# EasyEDA Pro project ProDocument_Board1612_2023-10-08.epro

# Schematic Schematic1_1
Create Date: 2023-08-06; Page Name: P1; Project Name: PressureSensor; Schematic Name: Schematic1_1; Update Date: 2023-08-13; Company: 嘉立创EDA; Page Size: A4; Version: V1.0
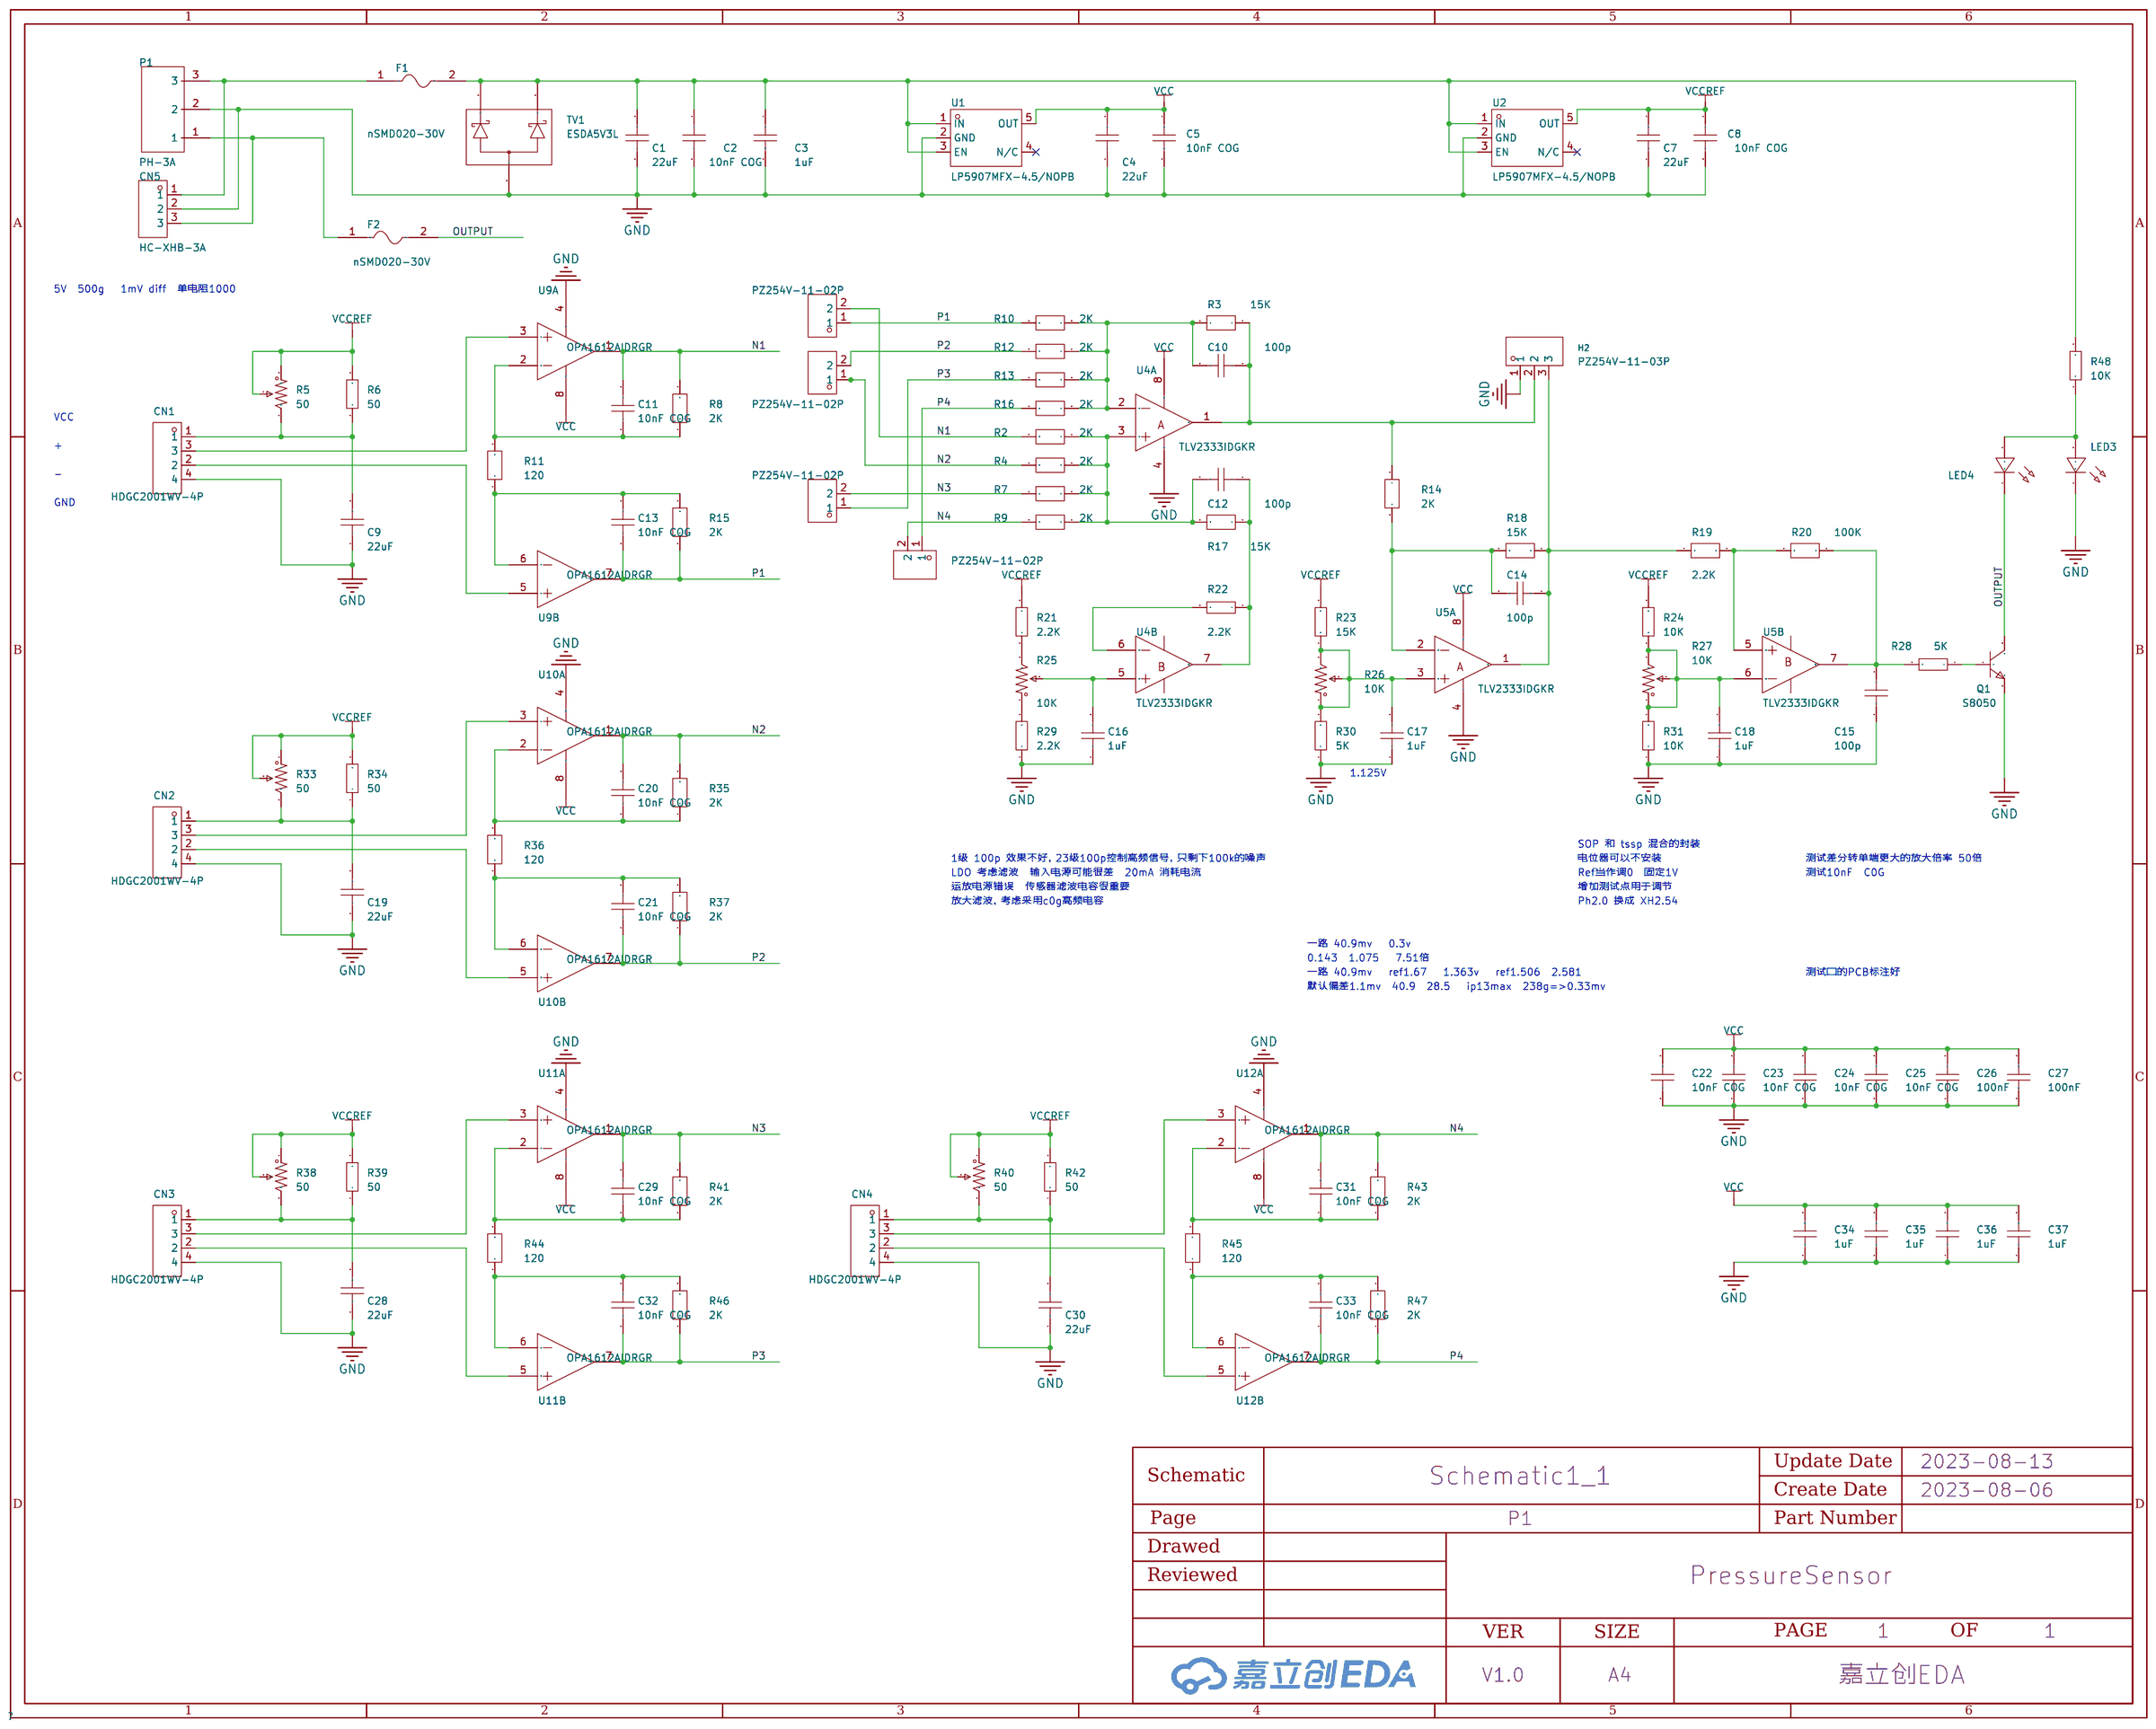
[diagram p0: schematic sheet]

## Parts
C1  22uF  [R0603]
C2  10nF COG  [R0603]
C3  1uF  [R0603]
C4  22uF  [R0603]
C5  10nF COG  [R0603]
C7  22uF  [R0603]
C8  10nF COG  [R0603]
C9  22uF  [R0603]
C10  100p  [R0603]
C11  10nF COG  [R0603]
C12  100p  [R0603]
C13  10nF COG  [R0603]
C14  100p  [R0603]
C15  100p  [R0603]
C16  1uF  [R0603]
C17  1uF  [R0603]
C18  1uF  [R0603]
C19  22uF  [R0603]
C20  10nF COG  [R0603]
C21  10nF COG  [R0603]
C22  10nF COG  [R0603]
C23  10nF COG  [R0603]
C24  10nF COG  [R0603]
C25  10nF COG  [R0603]
C26  100nF  [R0603]
C27  100nF  [R0603]
C28  22uF  [R0603]
C29  10nF COG  [R0603]
C30  22uF  [R0603]
C31  10nF COG  [R0603]
C32  10nF COG  [R0603]
C33  10nF COG  [R0603]
C34  1uF  [R0603]
C35  1uF  [R0603]
C36  1uF  [R0603]
C37  1uF  [R0603]
CN1  HDGC2001WV-4P  [CONN-TH_4P-P2.00_HDGC_HDGC2001WV-4P]
CN2  HDGC2001WV-4P  [CONN-TH_4P-P2.00_HDGC_HDGC2001WV-4P]
CN3  HDGC2001WV-4P  [CONN-TH_4P-P2.00_HDGC_HDGC2001WV-4P]
CN4  HDGC2001WV-4P  [CONN-TH_4P-P2.00_HDGC_HDGC2001WV-4P]
CN5  HC-XHB-3A  [CONN-TH_3P-P2.50_HC-XHB-3A]
F1  nSMD020-30V  [F1206]
F2  nSMD020-30V  [F1206]
H2  PZ254V-11-03P  [HDR-TH_3P-P2.54-V-M]
H5  PZ254V-11-02P  [HDR-TH_2P-P2.54-V-M]
H6  PZ254V-11-02P  [HDR-TH_2P-P2.54-V-M]
H7  PZ254V-11-02P  [HDR-TH_2P-P2.54-V-M]
H8  PZ254V-11-02P  [HDR-TH_2P-P2.54-V-M]
LED3  -  [LED_0603]
LED4  -  [LED_0603]
P1  PH-3A  [CONN-TH_12P-P2.00-H-W4.8_PH-3A]
Q1  S8050  [SOT-23-3_L2.9-W1.6-P1.90-LS2.8-BR]
R2  2K  [R0603]
R3  15K  [R0603]
R4  2K  [R0603]
R5  50  [RES-ADJ-TH_3P-L10.0-W10.0-P2.50-L]
R6  50  [R0603]
R7  2K  [R0603]
R8  2K  [R0603]
R9  2K  [R0603]
R10  2K  [R0603]
R11  120  [R0603]
R12  2K  [R0603]
R13  2K  [R0603]
R14  2K  [R0603]
R15  2K  [R0603]
R16  2K  [R0603]
R17  15K  [R0603]
R18  15K  [R0603]
R19  2.2K  [R0603]
R20  100K  [R0603]
R21  2.2K  [R0603]
R22  2.2K  [R0603]
R23  15K  [R0603]
R24  10K  [R0603]
R25  10K  [RES-ADJ-TH_3P-L10.0-W10.0-P2.50-L]
R26  10K  [RES-ADJ-TH_3P-L10.0-W10.0-P2.50-L]
R27  10K  [RES-ADJ-TH_3P-L10.0-W10.0-P2.50-L]
R28  5K  [R0603]
R29  2.2K  [R0603]
R30  5K  [R0603]
R31  10K  [R0603]
R33  50  [RES-ADJ-TH_3P-L10.0-W10.0-P2.50-L]
R34  50  [R0603]
R35  2K  [R0603]
R36  120  [R0603]
R37  2K  [R0603]
R38  50  [RES-ADJ-TH_3P-L10.0-W10.0-P2.50-L]
R39  50  [R0603]
R40  50  [RES-ADJ-TH_3P-L10.0-W10.0-P2.50-L]
R41  2K  [R0603]
R42  50  [R0603]
R43  2K  [R0603]
R44  120  [R0603]
R45  120  [R0603]
R46  2K  [R0603]
R47  2K  [R0603]
R48  10K  [R0603]
TV1  ESDA5V3L  [SOT-23-3_L2.9-W1.6-P1.90-LS2.8-BR]
U1  LP5907MFX-4.5/NOPB  [TSOT-23-5_L2.9-W1.6-P0.95-LS2.8-BR]
U2  LP5907MFX-4.5/NOPB  [TSOT-23-5_L2.9-W1.6-P0.95-LS2.8-BR]
U4  TLV2333IDGKR  [SOIC-8_L4.9-W3.9-P1.27-LS6.0-BL]  (sections 1,2)
U5  TLV2333IDGKR  [SOIC-8_L4.9-W3.9-P1.27-LS6.0-BL]  (sections 1,2)
U9  OPA1612AIDRGR  [SON-8_L3.0-W3.0-P0.50-TL-EP_OPA1612AIDRGR]  (sections 1,2)
U10  OPA1612AIDRGR  [SON-8_L3.0-W3.0-P0.50-TL-EP_OPA1612AIDRGR]  (sections 1,2)
U11  OPA1612AIDRGR  [SON-8_L3.0-W3.0-P0.50-TL-EP_OPA1612AIDRGR]  (sections 1,2)
U12  OPA1612AIDRGR  [SON-8_L3.0-W3.0-P0.50-TL-EP_OPA1612AIDRGR]  (sections 1,2)

## Library data of the parts
C1-C5 C7-C37 = CAP_0603: Supplier Footprint: 0603
CN1-CN4 = HDGC2001WV-4P: LCSC Part Name: PH2.0直针 4P; Supplier Part: C5175232; Manufacturer: HDGC(华德共创); Supplier Footprint: 直插,P=2mm; JLCPCB Part Class: Extended Part; Datasheet: https://atta.szlcsc.com/upload/public/pdf/source/20220916/C6875813FFA1039A4B3E585D63AEFA0D.pdf; Supplier: LCSC
CN5 = HC-XHB-3A_C2845491: 参考系列:-;间距:2.5mm;插针结构:1x3P;排数:1;每排PIN数:3;行距:-;公母:公型插针;安装方式:直插;额定电流:3A;工作温度范围:-25℃~+85℃;; LCSC Part Name: 2.54带锁扣立式插件 3P 针座连接器线对板/线对线连接器; Supplier Part: C2845491; Manufacturer: HCTL(华灿天禄); Supplier Footprint: 插件,P=2.5mm; JLCPCB Part Class: Extended Part; Datasheet: https://atta.szlcsc.com/upload/public/pdf/source/20210728/C2845490_C6E0123D5C5ECC46C6D4C91ADB43F484.pdf; Supplier: LCSC; Pitch: 2.5mm; Pins Structure: 1x3P; Number of Rows: 1; Number of PINs Per Row: 3; Gender: 公型插针; Mounting Style: 直插; Current Rating (Max): 3A; Operating Temperature Range: -25℃~+85℃
F1 F2 = nSMD020-30V: 最大电压:30V;最大电流:100A;保持电流:200mA;跳闸电流:460mA;; LCSC Part Name: 30V 200mA 1206自恢复; Supplier Part: C69680; Manufacturer: 台湾陆海; Supplier Footprint: 1206; JLCPCB Part Class: Extended Part; Datasheet: https://atta.szlcsc.com/upload/public/pdf/source/20230404/9F5B471D89C649BCC2835D46521A6324.pdf; Supplier: LCSC; Operating Voltage (Max): 30V; Current Rating (Max): 100A; Hold Current: 200mA; Trip Current: 460mA
H2 = PZ254V-11-03P: 排数:单排;总PIN位数:3;间距:2.54mm;插针结构:1x3P;行距:-;安装类型:直插;圆针/方针:方针;额定电流:3A;额定电压:250V;配合针长度:6mm;塑高:2.5mm;端接针长度:3mm;工作温度范围:-40℃~+105℃;颜色:黑色;; LCSC Part Name: 2.54mm 1x3P 直插 方针; Supplier Part: C2937625; Manufacturer: XFCN(兴飞); Supplier Footprint: 直插,P=2.54mm; JLCPCB Part Class: Extended Part; Datasheet: 2022-07-12/581362A/62b9d00620994b3696be7eb4af85ad72/双排排针和单排排针.pdf; Supplier: LCSC; Number of Rows: 单排; Number of Pins: 3; Pitch: 2.54mm; Pin Structure: 1x3P; Mounting Type: 直插; Circluar Pins/Square Pins: 方针; Current Rating (Max): 3A; Voltage Rating (Max): 250V; Length of Mating Pin: 6mm; Insulation Height: 2.5mm; Length of End Connection Pin: 3mm; Operating Temperature Range: -40℃~+105℃; Color: 黑色
H5-H8 = PZ254V-11-02P: 排数:单排;总PIN位数:2P;间距:2.54mm;插针结构:1x2P;行距:-;安装类型:直插;圆针/方针:方针;额定电流:-;额定电压:-;配合针长度:6mm;塑高:2.5mm;端接针长度:3mm;触头材质:黄铜;触头镀层:-;工作温度范围:-40℃~+105℃;颜色:黑色;; LCSC Part Name: 2.54mm 1x2P 直插 方针; Supplier Part: C492401; Manufacturer: XFCN(兴飞); Supplier Footprint: 插件,P=2.54mm; JLCPCB Part Class: Extended Part; Datasheet: https://atta.szlcsc.com/upload/public/pdf/source/20200309/C492401_A812433581A9B211A7FFA413ADDFF0E5.pdf; Supplier: LCSC; Number of Rows: 单排; Number of Pins: 2P; Pitch: 2.54mm; Pin Structure: 1x2P; Mounting Type: 直插; Circluar Pins/Square Pins: 方针; Length of Mating Pin: 6mm; Insulation Height: 2.5mm; Length of End Connection Pin: 3mm; Contact Material: 黄铜; Operating Temperature Range: -40℃~+105℃; Color: 黑色
LED3 LED4 = LED_0603-B: Supplier Footprint: 0603
P1 = PH-3A_C2320: 参考系列:PH;间距:2mm;插针结构:1x3P;排数:1;每排PIN数:3;行距:-;安装方式:-;触头材质:-;; LCSC Part Name: PH 2mm 1x3P 直插; Supplier Part: C2320; Manufacturer: BOOMELE(博穆精密); Supplier Footprint: 插件,P=2mm; JLCPCB Part Class: Extended Part; Datasheet: https://atta.szlcsc.com/upload/public/pdf/source/20151118/1457707579328.pdf; Supplier: LCSC; Reference Series: PH; Pitch: 2mm; Pins Structure: 1x3P; Number of Rows: 1; Number of PINs Per Row: 3
Q1 = S8050_C105433: 晶体管类型:NPN;集射极击穿电压(Vceo):25V;集电极电流(Ic):500mA;功率(Pd):300mW;直流电流增益(hFE@Ic,Vce):120@50mA,1V;; LCSC Part Name: NPN 25V 500mA L档 120-200; Supplier Part: C105433; Manufacturer: CJ(江苏长电/长晶); Supplier Footprint: SOT-23; JLCPCB Part Class: Extended Part; Datasheet: https://atta.szlcsc.com/upload/public/pdf/source/20170415/1492237762328.pdf; Supplier: LCSC; Transistor Type: NPN; Collector-Emitter Breakdown Voltage (Vceo): 25V; Collector Current (Ic): 500mA; Power Dissipation (Pd): 300mW; Collector Cut-Off Current (Icbo): 100nA; Collector-Emitter Saturation Voltage (VCE(sat)@Ic,Ib): 600mV@500mA,50mA; DC Current Gain (hFE@Ic,Vce): 120@50mA,1V; Transition Frequency (fT): 150MHz; Operating Temperature: +150℃@(Tj)
R2-R4 R7-R20 R35-R37 R41 R43-R47 = ARG02BTC4R70: 阻值:4.7Ω;精度:±0.1%;温度系数:±25ppm/℃;; LCSC Part Name: 4.7Ω ±0.1%; Supplier Part: C2984422; Manufacturer: Viking(光颉); Supplier Footprint: 0402; JLCPCB Part Class: Extended Part; Datasheet: https://atta.szlcsc.com/upload/public/pdf/source/20200117/C485675_99063924B4564AF910B7BE66DA8EFA49.pdf; Supplier: LCSC; Tolerance: ±0.1%; Temperature Coefficient: ±25ppm/℃
R5 R25-R27 R33 R38 R40 = 3296W-1-103: 阻值:10kΩ;精度:±10%;; LCSC Part Name: 10kΩ ±10%; Supplier Part: C118954; Manufacturer: BOCHEN(博晨); Supplier Footprint: 插件; JLCPCB Part Class: Extended Part; Datasheet: https://atta.szlcsc.com/upload/public/pdf/source/20171114/C118954_15106326646611117443.pdf; Supplier: LCSC; Tolerance: ±10%
R6 R21-R24 R28-R31 R34 R39 R42 R48 = Res_0603: Supplier Footprint: 0603
TV1 = ESDA5V3L_C87911: Supplier Part: C87911; Manufacturer: ST(意法半导体); Supplier Footprint: SOT-23; JLCPCB Part Class: Extended Part; Datasheet: https://atta.szlcsc.com/upload/public/pdf/source/20161123/1479873117957.pdf; Supplier: LCSC
U1 U2 = LP5907MFX-4.5/NOPB: 输出类型:-;; Supplier Part: C529554; Manufacturer: TI(德州仪器); Supplier Footprint: SOT-23-5; JLCPCB Part Class: Extended Part; Datasheet: https://atta.szlcsc.com/upload/public/pdf/source/20200515/C529554_1F6A3CAA36CA0E645A19879A5E39A7AD.pdf; Supplier: LCSC
U4 U5 = TLV2333IDGKR: 放大器组数:-;; Supplier Part: C527573; Manufacturer: TI(德州仪器); Supplier Footprint: VSSOP-8; JLCPCB Part Class: Extended Part; Datasheet: https://atta.szlcsc.com/upload/public/pdf/source/20200508/C527573_3F1EAB2C8CE40A63573F2737A046710C.pdf; Supplier: LCSC
U9-U12 = OPA1612AIDRGR: 具有 1.1nV/√Hz 噪声和较低 THD 的高精度 SoundPlus 音频运算放大器 8-SON -40 to 85; Supplier Part: C2058640; Manufacturer: TI(德州仪器); Supplier Footprint: SON-8-EP(3x3); JLCPCB Part Class: Extended Part; Datasheet: https://atta.szlcsc.com/upload/public/pdf/source/20230222/7014F0FC761208C0B48090C82932DC0C.pdf; Supplier: LCSC

## Nets
GND: C1.1 C2.2 C3.2 C4.1 C5.2 C7.1 C8.2 C9.1 C15.2 C16.1 C17.1 C18.1 C19.1 C22.1 C23.1 C24.1 C25.1 C26.1 C27.1 C28.1 C30.1 C34.1 C35.1 C36.1 C37.1 CN1.4 CN2.4 CN3.4 CN4.4 CN5.2 H2.1 LED3.1(C) P1.2 Q1.2 R29.1 R30.1 R31.1 TV1.3 U1.2(GND) U2.2(GND) U4.4(V-) U5.4(V-) U9.4(GND) U10.4(GND) U11.4(GND) U12.4(GND)
VCC: C4.2 C5.1 C22.2 C23.2 C24.2 C25.2 C26.2 C27.2 C34.2 C35.2 C36.2 C37.2 U1.5(OUT) U4.8(V+) U5.8(V+) U9.8(V+) U10.8(V+) U11.8(V+) U12.8(V+)
VCCREF: C7.2 C8.1 R5.1 R5.2 R6.2 R21.2 R23.2 R24.2 R33.1 R33.2 R34.2 R38.1 R38.2 R39.2 R40.1 R40.2 R42.2 U2.5(OUT)
N1: C11.2 H5.2 R2.2 R8.2 U9.1(OUTA)
N2: C20.2 H8.1 R4.2 R35.2 U10.1(OUTA)
N3: C29.2 H6.2 R7.2 R41.2 U11.1(OUTA)
N4: C31.2 H7.2 R9.2 R43.2 U12.1(OUTA)
OUTPUT: F2.2 LED4.1(C) Q1.3
P1: C13.1 H5.1 R10.2 R15.1 U9.7(OUTB)
P2: C21.1 H8.2 R12.2 R37.1 U10.7(OUTB)
P3: C32.1 H6.1 R13.2 R46.1 U11.7(OUTB)
P4: C33.1 H7.1 R16.2 R47.1 U12.7(OUTB)
$1N30553: CN1.3 U9.3(INA+)
$1N30561: CN1.2 U9.5(INB+)
$1N30605: C11.1 R8.1 R11.2 U9.2(INA-)
$1N30608: C13.2 R11.1 R15.2 U9.6(INB-)
$1N32010: R21.1 R25.3
$1N32012: R25.1 R29.2
$1N32045: C16.2 R25.2 U4.5(INB+)
$1N32103: R22.2 U4.6(INB-)
$1N32162: C10.2 R3.2 R10.1 R12.1 R13.1 R16.1 U4.2(INA-)
$1N32193: C12.1 R17.1 R22.1 U4.7(OUTB)
$1N32196: C12.2 R2.1 R4.1 R7.1 R9.1 R17.2 U4.3(INA+)
$1N33007: R19.2 R20.2 U5.5(INB+)
$1N33240: Q1.1 R28.1
$1N33276: C15.1 R20.1 R28.2 U5.7(OUTB)
$1N35532: C10.1 H2.2 R3.1 R14.1 U4.1(OUTA)
$1N36334: C14.1 H2.3 R18.1 R19.1 U5.1(OUTA)
$1N36352: C14.2 R14.2 R18.2 U5.2(INA-)
$1N36780: CN2.3 U10.3(INA+)
$1N36784: CN2.2 U10.5(INB+)
$1N36792: C20.1 R35.1 R36.2 U10.2(INA-)
$1N36797: C21.2 R36.1 R37.2 U10.6(INB-)
$1N37205: CN3.3 U11.3(INA+)
$1N37209: CN3.2 U11.5(INB+)
$1N37217: C29.1 R41.1 R44.2 U11.2(INA-)
$1N37222: C32.2 R44.1 R46.2 U11.6(INB-)
$1N37630: CN4.3 U12.3(INA+)
$1N37634: CN4.2 U12.5(INB+)
$1N37642: C31.1 R43.1 R45.2 U12.2(INA-)
$1N37647: C33.2 R45.1 R47.2 U12.6(INB-)
$1N37723: C19.2 CN2.1 R33.3 R34.1
$1N37747: C28.2 CN3.1 R38.3 R39.1
$1N37752: C9.2 CN1.1 R5.3 R6.1
$1N37762: C30.2 CN4.1 R40.3 R42.1
$1N42503: CN5.1 F1.1 P1.3
$1N42542: CN5.3 F2.1 P1.1
$1N42787: LED3.2(A) LED4.2(A) R48.1
$1N42798: C1.2 C2.1 C3.1 F1.2 R48.2 TV1.1 TV1.2 U1.1(IN) U1.3(EN) U2.1(IN) U2.3(EN)
$1N53934: C17.2 R23.1 R26.1 R26.2 R26.3 R30.2 U5.3(INA+)
$1N61093: C18.2 R24.1 R27.1 R27.2 R27.3 R31.2 U5.6(INB-)

Not connected (* = marked no-connect by the designer): U1 4(N/C)*; U2 4(N/C)*

## Notes on the sheet
- 5V  500g   1mV diff  单电阻1000
- VCC
- +
- -
- GND
- 1.125V
- SOP 和 tssp 混合的封装
- 1级 100p 效果不好，23级100p控制高频信号，只剩下100k的噪声
- 电位器可以不安装
- 测试差分转单端更大的放大倍率 50倍
- LDO 考虑滤波  输入电源可能很差  20mA 消耗电流
- 运放电源错误  传感器滤波电容很重要
- Ref当作调0  固定1V
- 增加测试点用于调节
- 测试10nF  C0G
- 放大滤波，考虑采用c0g高频电容
- Ph2.0 换成 XH2.54
- 一路 40.9mv   0.3v
- 0.143  1.075   7.51倍
- 一路 40.9mv   ref1.67   1.363v   ref1.506  2.581
- 默认偏差1.1mv  40.9  28.5   ip13max  238g=>0.33mv
- 测试口的PCB标注好

# Board PCB1_1
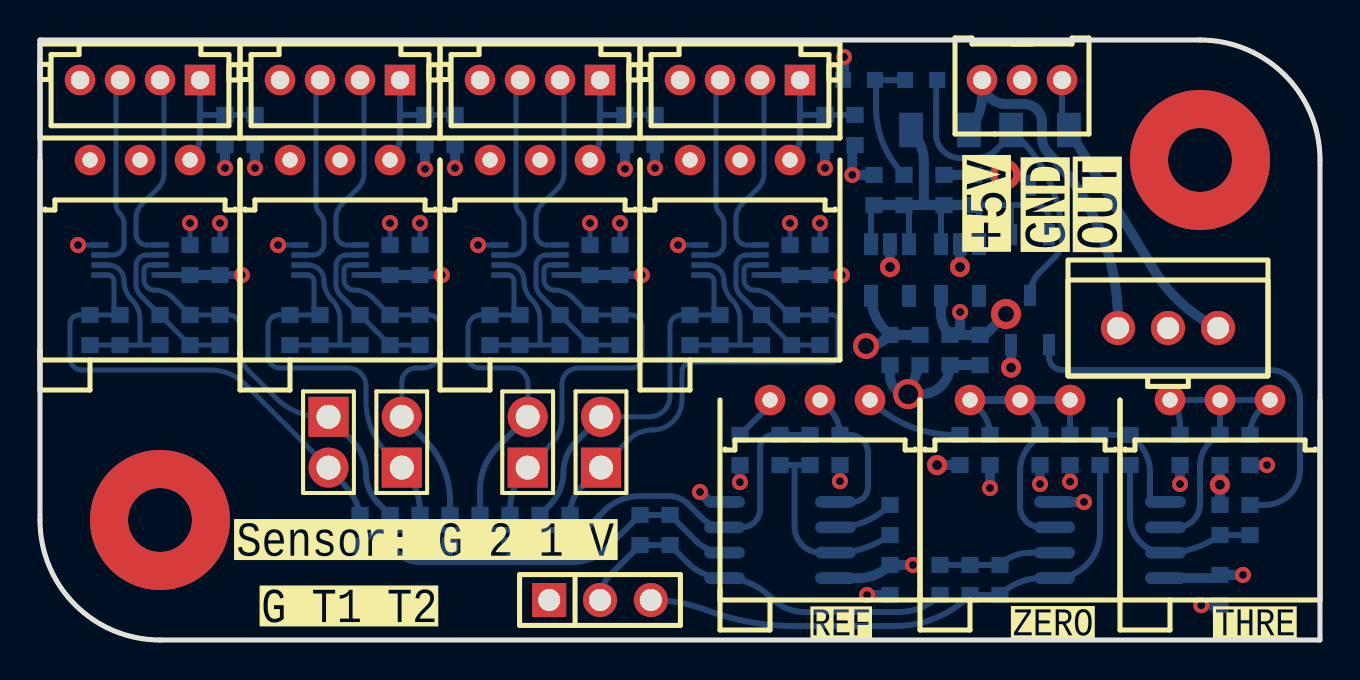
[diagram p1: board, top side]
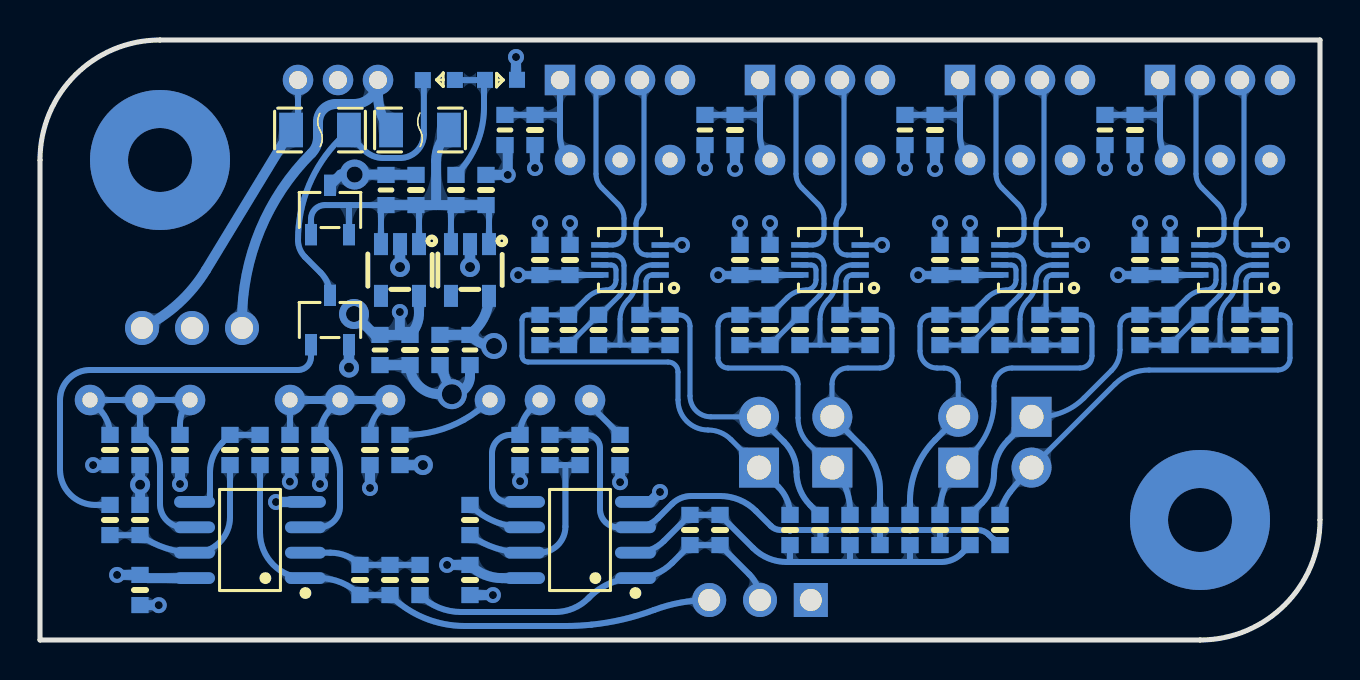
[diagram p2: board, bottom side, seen from below]

Outline 64 x 30 mm; copper layers: Top Layer, Inner1, Inner2, Bottom Layer. Coordinates in mm from the lower left corner of the outline.
Outline path: 0,6 0,30 58,30 arc(62.24,28.24) 64,24 64,0 6,0 arc(1.76,1.76) 0,6
Stack: Top Layer 0.035mm / Dielectric1 0.48mm PP er 4.5 / Inner1 0.035mm / Dielectric2 0.48mm FR4 er 4.5 / Inner2 0.035mm / Dielectric3 0.48mm PP er 4.5 / Bottom Layer 0.035mm

## Design rules (mm)
template: 自定义配置
spacing copperThickness1oz (default): track to track 0.102, other pairs 0.152 to 0.3
spacing copperThickness2oz: track to track 0.203, other pairs 0.152 to 0.3
track width copperThickness1oz (default): min 0.127, default 0.254, max 2.54
track width copperThickness2oz: min 0.203, default 0.254, max 2.54
differential pair differentialPair (default): width min 0.127, default 0.254, max 2.54; gap min 0.152, default 0.152
via viaSize (default): diameter min 0.5, default 0.61, max 10; hole min 0.3, default 0.305, max 6.3
net GND uses innerPlaneGND

## Placement (name value [footprint] x y rotation side)
C1  22uF  [R0603]  46.7 22.5 270 bottom
C2  10nF COG  [R0603]  45.2 22.5 90 bottom
C3  1uF  [R0603]  41.7 22.5 90 bottom
C4  22uF  [R0603]  42.5 14.5 90 bottom
C5  10nF COG  [R0603]  44 14.5 270 bottom
C7  22uF  [R0603]  47 14.5 90 bottom
C8  10nF COG  [R0603]  45.5 14.5 270 bottom
C9  22uF  [R0603]  10.75 25.5 90 bottom
C10  100p  [R0603]  31.5 5.5 90 bottom
C11  10nF COG  [R0603]  2.5 15.5 90 bottom
C12  100p  [R0603]  38.5 9.5 90 bottom
C13  10nF COG  [R0603]  9 15.5 270 bottom
C14  100p  [R0603]  46.5 3 90 bottom
C15  100p  [R0603]  59 6 90 bottom
C16  1uF  [R0603]  40 9.5 90 bottom
C17  1uF  [R0603]  50 9.5 90 bottom
C18  1uF  [R0603]  59 9.5 90 bottom
C19  22uF  [R0603]  20.75 25.5 90 bottom
C20  10nF COG  [R0603]  12.5 15.5 90 bottom
C21  10nF COG  [R0603]  19 15.5 270 bottom
C22  10nF COG  [R0603]  7.5 19 270 bottom
C23  10nF COG  [R0603]  17.5 19 270 bottom
C24  10nF COG  [R0603]  27.5 19 270 bottom
C25  10nF COG  [R0603]  37.5 19 270 bottom
C26  100nF  [R0603]  42.5 3 90 bottom
C27  100nF  [R0603]  59 2.5 90 bottom
C28  22uF  [R0603]  30.75 25.5 90 bottom
C29  10nF COG  [R0603]  22.5 15.5 90 bottom
C30  22uF  [R0603]  40.75 25.5 90 bottom
C31  10nF COG  [R0603]  32.5 15.5 90 bottom
C32  10nF COG  [R0603]  29 15.5 270 bottom
C33  10nF COG  [R0603]  39 15.5 270 bottom
C34  1uF  [R0603]  39 19 270 bottom
C35  1uF  [R0603]  29 19 270 bottom
C36  1uF  [R0603]  19 19 270 bottom
C37  1uF  [R0603]  9 19 270 bottom
CN1  HDGC2001WV-4P  [CONN-TH_4P-P2.00_HDGC_HDGC2001WV-4P]  5 28 180 top
CN2  HDGC2001WV-4P  [CONN-TH_4P-P2.00_HDGC_HDGC2001WV-4P]  15 28 180 top
CN3  HDGC2001WV-4P  [CONN-TH_4P-P2.00_HDGC_HDGC2001WV-4P]  25 28 180 top
CN4  HDGC2001WV-4P  [CONN-TH_4P-P2.00_HDGC_HDGC2001WV-4P]  35 28 180 top
CN5  HC-XHB-3A  [CONN-TH_3P-P2.50_HC-XHB-3A]  56.4 15.6 0 top
F1  nSMD020-30V  [F1206]  45 25.5 180 bottom
F2  nSMD020-30V  [F1206]  50 25.5 180 bottom
H2  PZ254V-11-03P  [HDR-TH_3P-P2.54-V-M]  28 2 0 top
H5  PZ254V-11-02P  [HDR-TH_2P-P2.54-V-M]  14.42 9.89 270 top
H6  PZ254V-11-02P  [HDR-TH_2P-P2.54-V-M]  24.38 9.89 90 top
H7  PZ254V-11-02P  [HDR-TH_2P-P2.54-V-M]  28.05 9.89 90 top
H8  PZ254V-11-02P  [HDR-TH_2P-P2.54-V-M]  18.09 9.89 90 top
LED3  -  [LED_0603]  41 28 0 bottom
LED4  -  [LED_0603]  44.01 28.01 180 bottom
P1  PH-3A  [CONN-TH_12P-P2.00-H-W4.8_PH-3A]  49.1 28 270 top
Q1  S8050  [SOT-23-3_L2.9-W1.6-P1.90-LS2.8-BR]  49.5 16 270 bottom
R2  2K  [R0603]  16 5.5 90 bottom
R3  15K  [R0603]  30 5.5 90 bottom
R4  2K  [R0603]  19 5.5 90 bottom
R5  50  [RES-ADJ-TH_3P-L10.0-W10.0-P2.50-L]  5 24 0 top
R6  50  [R0603]  9.25 25.5 270 bottom
R7  2K  [R0603]  22 5.5 90 bottom
R8  2K  [R0603]  4 15.5 90 bottom
R9  2K  [R0603]  25 5.5 90 bottom
R10  2K  [R0603]  17.5 5.5 90 bottom
R11  120  [R0603]  6 15.5 270 bottom
R12  2K  [R0603]  20.5 5.5 90 bottom
R13  2K  [R0603]  23.5 5.5 90 bottom
R14  2K  [R0603]  45 3 90 bottom
R15  2K  [R0603]  7.5 15.5 270 bottom
R16  2K  [R0603]  26.5 5.5 90 bottom
R17  15K  [R0603]  37 9.5 90 bottom
R18  15K  [R0603]  48 3 90 bottom
R19  2.2K  [R0603]  53 9.5 90 bottom
R20  100K  [R0603]  54.5 9.5 90 bottom
R21  2.2K  [R0603]  46 9.5 270 bottom
R22  2.2K  [R0603]  42.5 6 90 bottom
R23  15K  [R0603]  51.5 9.5 270 bottom
R24  10K  [R0603]  60.5 9.5 270 bottom
R25  10K  [RES-ADJ-TH_3P-L10.0-W10.0-P2.50-L]  39 12 0 top
R26  10K  [RES-ADJ-TH_3P-L10.0-W10.0-P2.50-L]  49 12 0 top
R27  10K  [RES-ADJ-TH_3P-L10.0-W10.0-P2.50-L]  59 12 0 top
R28  5K  [R0603]  60.5 6 270 bottom
R29  2.2K  [R0603]  35 9.5 90 bottom
R30  5K  [R0603]  47.5 9.5 90 bottom
R31  10K  [R0603]  57 9.5 90 bottom
R33  50  [RES-ADJ-TH_3P-L10.0-W10.0-P2.50-L]  15 24 0 top
R34  50  [R0603]  19.25 25.5 270 bottom
R35  2K  [R0603]  14 15.5 90 bottom
R36  120  [R0603]  16 15.5 270 bottom
R37  2K  [R0603]  17.5 15.5 270 bottom
R38  50  [RES-ADJ-TH_3P-L10.0-W10.0-P2.50-L]  25 24 0 top
R39  50  [R0603]  29.25 25.5 270 bottom
R40  50  [RES-ADJ-TH_3P-L10.0-W10.0-P2.50-L]  35 24 0 top
R41  2K  [R0603]  24 15.5 90 bottom
R42  50  [R0603]  39.25 25.5 270 bottom
R43  2K  [R0603]  34 15.5 90 bottom
R44  120  [R0603]  26 15.5 270 bottom
R45  120  [R0603]  36.07 15.5 270 bottom
R46  2K  [R0603]  27.5 15.5 270 bottom
R47  2K  [R0603]  37.57 15.5 270 bottom
R48  10K  [R0603]  43.2 22.5 270 bottom
TV1  ESDA5V3L  [SOT-23-3_L2.9-W1.6-P1.90-LS2.8-BR]  49.5 21.5 270 bottom
U1  LP5907MFX-4.5/NOPB  [TSOT-23-5_L2.9-W1.6-P0.95-LS2.8-BR]  42.5 18.5 90 bottom
U2  LP5907MFX-4.5/NOPB  [TSOT-23-5_L2.9-W1.6-P0.95-LS2.8-BR]  46 18.5 90 bottom
U4  TLV2333IDGKR  [SOIC-8_L4.9-W3.9-P1.27-LS6.0-BL]  37 5 90 bottom
U5  TLV2333IDGKR  [SOIC-8_L4.9-W3.9-P1.27-LS6.0-BL]  53.5 5 90 bottom
U9  OPA1612AIDRGR  [SON-8_L3.0-W3.0-P0.50-TL-EP_OPA1612AIDRGR]  4.5 19 0 bottom
U10  OPA1612AIDRGR  [SON-8_L3.0-W3.0-P0.50-TL-EP_OPA1612AIDRGR]  14.5 19 0 bottom
U11  OPA1612AIDRGR  [SON-8_L3.0-W3.0-P0.50-TL-EP_OPA1612AIDRGR]  24.5 19 0 bottom
U12  OPA1612AIDRGR  [SON-8_L3.0-W3.0-P0.50-TL-EP_OPA1612AIDRGR]  34.5 19 0 bottom

## Footprints (pads in the part's own frame, mm; a bottom-side part is the same pattern mirrored in y, then rotated)
CONN-TH_3P-P2.50_HC-XHB-3A
  round 1.7 hole 1.1: 1(-2.5,0) 2(0,0) 3(2.5,0)
CONN-TH_4P-P2.00_HDGC_HDGC2001WV-4P
  rect 1.524x1.524 hole 0.914: 1(-3,0)
  round 1.524 hole 0.914: 2(-1,0) 3(1,0) 4(3,0)
CONN-TH_12P-P2.00-H-W4.8_PH-3A
  round 1.524 hole 0.9: 1(0,2) 2(0,0) 3(0,-2)
F1206
  rect 1.19x1.728 smd: 1(-1.445,0) 2(1.445,0)
HDR-TH_2P-P2.54-V-M
  rect 2x2 hole 1.2: 1(-1.27,0)
  round 2 hole 1.2: 2(1.27,0)
HDR-TH_3P-P2.54-V-M
  rect 1.7x1.7 hole 1.1: 1(-2.54,0)
  round 1.7 hole 1.1: 2(0,0) 3(2.54,0)
LED_0603
  rect 0.8x0.8 smd: 1(-0.851,-0.01) 2(0.75,-0.005)
R0603
  rect 0.806x0.864 smd: 1(-0.753,0) 2(0.753,0)
RES-ADJ-TH_3P-L10.0-W10.0-P2.50-L
  round 1.524 hole 0.762: 1(-2.5,0) 2(0,0) 3(2.5,0)
SOIC-8_L4.9-W3.9-P1.27-LS6.0-BL
  oval 0.588x2.045 smd: 1(-1.905,-2.772) 2(-0.635,-2.772) 3(0.635,-2.772) 4(1.905,-2.772) 5(1.905,2.772) 6(0.635,2.772) 7(-0.635,2.772) 8(-1.905,2.772)
SON-8_L3.0-W3.0-P0.50-TL-EP_OPA1612AIDRGR
  rect 0.865x0.28 smd: 1(-1.508,0.75) 2(-1.508,0.25) 3(-1.508,-0.25) 4(-1.508,-0.75) 5(1.508,-0.755) 6(1.508,-0.255) 7(1.508,0.245) 8(1.508,0.745)
SOT-23-3_L2.9-W1.6-P1.90-LS2.8-BR
  rect 1.07x0.6 smd: 1(1.235,-0.95) 2(1.235,0.95) 3(-1.235,0)
TSOT-23-5_L2.9-W1.6-P0.95-LS2.8-BR
  rect 1.1x0.7 smd: 1(1.294,-0.951) 2(1.294,-0.001) 3(1.294,0.951) 4(-1.294,0.951) 5(-1.294,-0.949)

## Nets
As in the schematic.

Pads without a net: U1 4; U2 4

## Via types
v1: diameter 7, hole 3.2, Top Layer to Bottom Layer, 2 vias
v2: diameter 0.8, hole 0.4, Top Layer to Bottom Layer, 39 vias
v3: diameter 1, hole 0.5, Top Layer to Bottom Layer, 5 vias
v4: diameter 1.5, hole 0.8, Top Layer to Bottom Layer, 2 vias
v5: diameter 1.5, hole 1, Top Layer to Bottom Layer, 1 via
v6: diameter 1.3, hole 0.8, Top Layer to Bottom Layer, 1 via

## Routing (per net, layer and track width the routed paths; a pad name or vN(x,y) marks a point on that pad's centre or on a via; arc(x,y) is an arc through that point)
GND: length 47.8
  Bottom Layer w0.25: C25.1 v2(37.5,20.85) ; C36.1 v2(19,20.85) ; C24.1 v2(27.5,20.85) ; U12.4 v2(31.9,19.75) ; C34.1 v2(39,20.85) ; C35.1 v2(29,20.85) ; U10.4 v2(11.9,19.75) ; C37.1 v2(9,20.85) ; U9.4 v2(1.9,19.75) ; C22.1 v2(7.5,20.85) ; C23.1 v2(17.5,20.85) ; U11.4 v2(21.9,19.75)
  Bottom Layer w0.5: v2(47.5,7.6) R30.1 ; C7.1 C8.2 arc(45.07,12.72) 44.04,12.29 v5(43.41,12.29) ; v2(58.06,1.74) 58.91,1.74 58.95,1.7 ; U4.4 34.22,6.9 33.5,6.9 v2(33,7.4) ; U5.4 50.73,6.9 v2(52.2,6.9) ; v2(57,7.8) R31.1 ; C28.1 v2(30.75,23.6) ; TV1.3 48.96,23.27 v4(48.27,23.27) C2.2 ; U2.2 v3(46,18.65) ; v2(40,7.94) 40,8.7 40,8.7 ; U1.2 v3(42.5,18.65) ; C15.2 59,6.76 v3(59,7.76) 59,8.74 C18.1 ; C3.2 v2(40.61,23.25) 40.61,24.61 C30.1 ; 40.2,28 v2(40.2,29.15) ; C26.1 v2(41.35,2.25) ; C9.1 v2(10.75,23.6) ; C4.1 42.5,13.2 arc(42.77,12.56) v5(43.41,12.29) ; C5.2 v5(43.41,12.29) ; C19.1 v2(20.75,23.6) ; Q1.2 v3(48.55,13.62) ; v2(50,7.8) C17.1 ; v2(35,7.89) 35,8.65
VCC: length 29.8
  Bottom Layer w0.3: C25.2 37.5,18.25 35.91,18.25 ; 5.91,18.25 7.5,18.25 ; C23.2 17.5,18.25 15.91,18.25 ; 25.91,18.25 27.5,18.25 C24.2
  Bottom Layer w0.4: C37.2 v2(10.09,18.25) ; C34.2 v2(40.09,18.25) ; C36.2 v2(20.09,18.25) ; C35.2 v2(30.09,18.25)
  Bottom Layer w0.5: C22.2 C37.2 ; C4.2 C5.1 ; C4.2 42.26,15.49 arc(41.74,16.28) U1.5 ; C4.2 42.47,15.23 arc(41.94,14.84) v6(41.3,14.7) ; v2(43.65,3.75) C26.2 arc(41.77,3.27) 40.91,3.09 U4.8 ; U5.8 58.62,3.09 arc(58.82,3.14) C27.2 v2(60.15,3.25) ; C25.2 C34.2 ; C36.2 17.5,18.25 arc(17.5,18.25) 17.5,18.25 ; C24.2 C35.2
VCCREF: length 13.8
  Bottom Layer w0.5: R6.2 v2(9.25,23.6) ; U2.5 45.05,16.34 arc(45.17,15.75) C8.1 C7.2 47.25,15.25 v4(48.3,16.3) ; 29.25,24.7 v2(29.25,23.56) ; 46.01,15.25 v2(46.01,16.4) ; R42.2 v2(39.25,23.6) ; v2(61.35,8.75) R24.2 ; 19.25,24.7 v2(19.25,23.55) ; 51.5,8.7 51.51,8.69 v2(51.51,7.92) ; R21.2 v3(44.85,8.75)
(no net):
  vias: v1(6,6) v1(58,24)
N1: length 25.2
  Bottom Layer w0.25: H5.2 10.25,12.79 arc(9.47,13.32) 8.54,13.5 2.1,13.5 arc(1.68,13.68) 1.5,14.1 1.5,15.8 arc(1.63,16.12) 1.95,16.25 C11.2 R8.2 arc(3.79,16.34) 3.7,16.55 3.7,17.93 arc(3.61,18.16) 3.38,18.25 3.09,18.25
  Bottom Layer w0.3: R2.2 arc(15.82,6.86) 15.5,7.4 arc(14.98,8.03) H5.2
N2: length 20.1
  Bottom Layer w0.25: 13.09,18.25 13.38,18.25 arc(13.61,18.16) 13.7,17.93 13.7,16.55 arc(13.79,16.34) R35.2 C20.2 11.95,16.25 arc(11.56,16.09) 11.4,15.7 11.4,14.2 arc(11.58,13.78) 12,13.6 15.4,13.6 arc(16.04,13.34) 16.3,12.7 16.3,11.94 arc(16.58,10.52) 17.39,9.32 H8.1
  Bottom Layer w0.3: R4.2 19,6.42 arc(18.76,7.61) H8.1
N3: length 18.2
  Bottom Layer w0.25: 23.09,18.25 23.38,18.25 arc(23.61,18.16) 23.7,17.93 23.7,16.55 arc(23.79,16.34) R41.2 C29.2 22.05,16.25 arc(21.59,16.06) 21.4,15.6 21.4,14.2 arc(21.58,13.78) 22,13.6 23.6,13.6 arc(24.17,13.37) 24.4,12.8 24.4,11.18 arc(24.4,11.16) H6.2
  Bottom Layer w0.3: H6.2 22.9,9.68 arc(22.23,8.68) 22,7.5 R7.2
N4: length 19
  Bottom Layer w0.25: 33.09,18.25 33.38,18.25 arc(33.61,18.16) 33.7,17.93 33.7,16.55 arc(33.79,16.34) R43.2 C31.2 32.05,16.25 arc(31.66,16.09) 31.5,15.7 31.5,12.2 arc(31.2,11.46) 30.46,11.16 H7.2
  Bottom Layer w0.3: R9.2 25.49,6.74 arc(26,7.5) 26.18,8.4 arc(26.34,9.22) 26.8,9.92 H7.2
OUTPUT: length 17.2
  Bottom Layer w0.3: 44.81,28 44.81,25.29 arc(45.16,24.45) 46,24.1 46.83,24.1 arc(47.36,24.2) 47.8,24.5 48.38,25.08 arc(48.51,25.22) 48.56,25.4 ; F2.2 49.01,25.04 arc(50.56,22.73) 51.1,20 arc(51.01,19.54) 50.75,19.15 49.97,18.37 arc(49.62,17.85) Q1.3
P1: length 20.4
  Bottom Layer w0.25: 5.91,18.75 5.45,18.75 arc(5.27,18.68) 5.2,18.5 5.2,18 arc(5.35,17.65) 5.7,17.5 arc(6.21,17.4) 6.64,17.11 R15.1 C13.1 9.45,16.25 arc(9.84,16.09) 10,15.7 10,14.5 arc(10.11,13.95) 10.42,13.48 11.8,12.1 arc(12.84,11.4) 14.07,11.16 H5.1
  Bottom Layer w0.3: H5.1 15.6,9.98 arc(16.12,9.21) 16.3,8.3 arc(16.46,7.52) 16.9,6.85 R10.2
P2: length 18.7
  Bottom Layer w0.25: 15.91,18.75 15.45,18.75 arc(15.27,18.68) 15.2,18.5 15.2,18 arc(15.35,17.65) 15.7,17.5 arc(16.21,17.4) 16.64,17.11 R37.1 C21.1 19.45,16.25 arc(19.84,16.09) 20,15.7 20,14.45 arc(19.75,13.85) 19.15,13.6 18.8,13.6 arc(18.3,13.39) 18.09,12.89 H8.2
  Bottom Layer w0.3: H8.2 19.25,10 arc(20.17,8.61) 20.5,6.97 R12.2
P3: length 21.1
  Bottom Layer w0.25: H6.1 25.56,9.8 arc(25.96,10.39) 26.1,11.1 26.1,12.8 arc(26.33,13.37) 26.9,13.6 29.6,13.6 arc(29.95,13.75) 30.1,14.1 30.1,15.7 arc(29.94,16.09) 29.55,16.25 C32.1 R46.1 26.64,17.11 arc(26.21,17.4) 25.7,17.5 arc(25.35,17.65) 25.2,18 25.2,18.5 arc(25.27,18.68) 25.45,18.75 25.91,18.75
  Bottom Layer w0.3: R13.2 23.5,6.49 arc(23.73,7.64) H6.1
P4: length 27.4
  Bottom Layer w0.25: 37.5,16.25 36.64,17.11 arc(36.21,17.4) 35.7,17.5 arc(35.35,17.65) 35.2,18 35.2,18.5 arc(35.27,18.68) 35.45,18.75 35.91,18.75 ; H7.1 29.45,10.03 arc(29.98,10.38) 30.6,10.5 arc(31.66,10.94) 32.1,12 32.1,13.4 arc(32.25,13.75) 32.6,13.9 39.6,13.9 arc(39.81,13.99) 39.9,14.2 39.9,16 arc(39.83,16.18) 39.65,16.25 C33.1 R47.1
  Bottom Layer w0.3: 28.51,8.81 arc(28.3,8.67) H7.1 27.08,7.65 arc(26.65,7.01) R16.2
$1N30553: length 9.8
  Bottom Layer w0.25: 3.09,19.25 3.65,19.25 arc(4.04,19.41) 4.2,19.8 4.2,20.82 arc(4.15,21.08) 4,21.3 arc(3.85,21.52) 3.8,21.78 3.8,27.52 arc(3.85,27.78) CN1.3
$1N30561: length 9.7
  Bottom Layer w0.25: 5.91,19.75 5.35,19.75 arc(4.96,19.91) 4.8,20.3 4.8,21.08 arc(4.88,21.47) 5.1,21.8 5.92,22.62 arc(6.13,22.93) 6.2,23.3 6.2,27.52 arc(6.15,27.78) CN1.2
$1N30605: length 8.5
  Bottom Layer w0.25: C11.1 R8.1 5,14.75 ; 5,14.75 5,16.04 arc(4.9,16.56) 4.6,17 arc(4.3,17.44) 4.2,17.97 arc(3.97,18.52) 3.42,18.75 3.09,18.75 ; 5,14.75 R11.2
$1N30608: length 8
  Bottom Layer w0.25: C13.2 R15.2 R11.1 5.05,17.21 arc(4.86,17.48) 4.8,17.8 4.8,18.72 arc(4.95,19.1) 5.33,19.25 5.91,19.25
$1N32010: length 5
  Bottom Layer w0.3: R21.1 45.72,10.25 arc(44.21,10.45) 42.81,11.01 arc(42.12,11.46) R25.3
$1N32012: length 2.3
  Bottom Layer w0.3: R29.2 36.33,11.58 arc(36.45,11.77) R25.1
$1N32045: length 7.7
  Bottom Layer w0.3: U4.5 40.64,6.91 arc(41.18,7.13) 41.4,7.66 41.4,9.34 arc(41.13,9.99) 40.48,10.25 C16.2 arc(39.86,10.94) 39.47,11.53 R25.2
$1N32103: length 3
  Bottom Layer w0.3: R22.2 arc(41.25,5.92) U4.6
$1N32162: length 21.1
  Bottom Layer w0.3: C10.2 R3.2 28.34,4.6 arc(27.57,4.08) 26.66,3.9 26.47,3.9 ; 20.5,3.9 23.51,3.9 ; 20.5,3.9 18.95,3.9 arc(18.39,4.01) 17.92,4.32 R10.1 ; 20.5,3.9 arc(20.5,3.9) 20.5,3.91 R12.1 ; 23.51,3.9 26.47,3.9 ; 23.51,3.9 arc(23.5,3.91) 23.5,3.92 R13.1 ; R16.1 26.5,3.98 arc(26.49,3.94) 26.47,3.9 ; 31.5,6.25 32.8,4.95 arc(33.45,4.52) 34.22,4.36 U4.2
$1N32193: length 10.3
  Bottom Layer w0.3: 37.73,8.75 37.73,5.67 arc(38.11,4.75) 39.03,4.36 U4.7 arc(41.21,4.59) R22.1 ; 37.73,8.75 C12.1 ; 37.73,8.75 R17.1
$1N32196: length 29.8
  Bottom Layer w0.3: C12.2 R17.2 36.66,10.25 arc(36.19,10.06) 36,9.59 36,6.54 arc(35.74,5.9) 35.1,5.64 U4.3 arc(33.62,5.76) 33.1,6.1 32.4,6.8 arc(31.96,7.1) 31.43,7.2 30,7.2 arc(29.03,7.01) 28.21,6.46 27.45,5.7 arc(27.23,5.55) 26.97,5.5 24.99,5.5 ; 16.28,5.03 16.31,5.01 16.57,5.28 arc(16.82,5.44) 17.11,5.5 19,5.5 ; 22.01,5.5 24.99,5.5 ; 22.01,5.5 19,5.5 ; 22.01,5.5 arc(22,5.48) 22,5.47 R7.1 ; 24.99,5.5 24.99,4.78 arc(24.99,4.76) R9.1 ; 19,5.5 arc(19,5.5) 19,5.5 R4.1 ; 23.5,5.48 arc(23.5,5.49) 23.51,5.5 ; 26.5,5.45 arc(26.5,5.48) 26.52,5.5 ; 20.5,5.47 arc(20.5,5.49) 20.51,5.5
$1N33007: length 5.9
  Bottom Layer w0.3: R19.2 R20.2 54.9,9.86 arc(55.34,9.19) 55.5,8.4 55.5,6.91 U5.5
$1N33240: length 21.4
  Bottom Layer w0.3: R28.1 61.24,6.75 arc(62.48,7.27) 63,8.52 63,12 arc(62.56,13.06) 61.5,13.5 51.1,13.5 arc(50.64,13.69) 50.45,14.15 Q1.1
$1N33276: length 9.8
  Bottom Layer w0.3: R20.1 54.5,6.14 arc(55.02,4.88) U5.7 arc(57.71,4.59) C15.1 arc(59.75,5.25) 60.5,5.24
$1N35532: length 19.8
  Bottom Layer w0.3: 31.5,4.75 32.39,3.86 arc(33.23,3.29) U4.1 arc(35.47,2.85) 36.53,2.14 36.59,2.08 arc(37.34,1.58) 38.23,1.4 42.96,1.4 arc(44.06,1.62) R14.1 ; C10.1 R3.1 28.53,3.27 arc(28.14,2.69) H2.2
$1N36334: length 27.9
  Bottom Layer w0.3: R19.1 53,5.37 arc(52.33,3.76) U5.1 50.05,3.09 arc(48.94,2.87) R18.1 C14.1 arc(44.79,1.1) 42.77,0.7 37.68,0.7 arc(37.06,0.72) 36.44,0.77 arc(34.84,1.03) 33.3,1.5 arc(31.94,1.87) H2.3
$1N36352: length 5.9
  Bottom Layer w0.3: R14.2 C14.2 R18.2 arc(48.68,4.21) 49.48,4.36 U5.2
$1N36780: length 9.8
  Bottom Layer w0.25: 13.09,19.25 13.65,19.25 arc(14.04,19.41) 14.2,19.8 14.2,20.82 arc(14.15,21.08) 14,21.3 arc(13.85,21.52) 13.8,21.78 13.8,27.52 arc(13.85,27.78) CN2.3
$1N36784: length 9.7
  Bottom Layer w0.25: 15.91,19.75 15.35,19.75 arc(14.96,19.91) 14.8,20.3 14.8,21.08 arc(14.88,21.47) 15.1,21.8 15.92,22.62 arc(16.13,22.93) 16.2,23.3 16.2,27.52 arc(16.15,27.78) CN2.2
$1N36792: length 8.5
  Bottom Layer w0.25: 13.09,18.75 13.42,18.75 arc(13.97,18.52) 14.2,17.97 arc(14.3,17.44) 14.6,17 arc(14.9,16.56) 15,16.04 15,14.75 ; C20.1 R35.1 R36.2
$1N36797: length 8
  Bottom Layer w0.25: 15.91,19.25 15.32,19.25 arc(14.95,19.1) 14.8,18.72 14.8,17.8 arc(14.86,17.48) 15.04,17.21 R36.1 17.5,14.76 arc(17.5,14.75) R37.2 C21.2
$1N37205: length 9.8
  Bottom Layer w0.25: 23.09,19.25 23.65,19.25 arc(24.04,19.41) 24.2,19.8 24.2,20.82 arc(24.15,21.08) 24,21.3 arc(23.85,21.52) 23.8,21.78 23.8,27.52 arc(23.85,27.78) CN3.3
$1N37209: length 9.7
  Bottom Layer w0.25: 25.91,19.75 25.35,19.75 arc(24.96,19.91) 24.8,20.3 24.8,21.08 arc(24.88,21.47) 25.1,21.8 25.92,22.62 arc(26.13,22.93) 26.2,23.3 26.2,27.52 arc(26.15,27.78) CN3.2
$1N37217: length 8.5
  Bottom Layer w0.25: R44.2 R41.1 C29.1 ; 23.09,18.75 23.42,18.75 arc(23.97,18.52) 24.2,17.97 arc(24.3,17.44) 24.6,17 arc(24.9,16.56) 25,16.04 25,14.75
$1N37222: length 8
  Bottom Layer w0.25: 25.91,19.25 25.32,19.25 arc(24.95,19.1) 24.8,18.72 24.8,17.8 arc(24.86,17.48) 25.04,17.21 R44.1 27.5,14.76 arc(27.5,14.75) R46.2 C32.2
$1N37630: length 9.8
  Bottom Layer w0.25: 33.09,19.25 33.65,19.25 arc(34.04,19.41) 34.2,19.8 34.2,20.82 arc(34.15,21.08) 34,21.3 arc(33.85,21.52) 33.8,21.78 33.8,27.52 arc(33.85,27.78) CN4.3
$1N37634: length 9.7
  Bottom Layer w0.25: 35.91,19.75 35.35,19.75 arc(34.96,19.91) 34.8,20.3 34.8,21.08 arc(34.88,21.47) 35.1,21.8 35.92,22.62 arc(36.13,22.93) 36.2,23.3 36.2,27.52 arc(36.15,27.78) CN4.2
$1N37642: length 8.6
  Bottom Layer w0.25: 35,14.75 35,16.04 arc(34.9,16.56) 34.6,17 arc(34.3,17.44) 34.2,17.97 arc(33.97,18.52) 33.42,18.75 33.09,18.75 ; C31.1 R43.1 R45.2
$1N37647: length 7.9
  Bottom Layer w0.25: 36,16.25 35.04,17.21 arc(34.86,17.48) 34.8,17.8 34.8,18.72 arc(34.95,19.1) 35.32,19.25 35.91,19.25 ; C33.2 R47.2 arc(37.57,14.75) 37.57,14.76 R45.1
$1N37723: length 6.8
  Bottom Layer w0.3: CN2.1 18,25.21 arc(17.87,24.55) R33.3 ; C19.2 R34.1 18.06,26.25
$1N37747: length 6.8
  Bottom Layer w0.3: 28.06,26.25 R39.1 C28.2 ; CN3.1 28,25.21 arc(27.87,24.55) R38.3
$1N37752: length 6.9
  Bottom Layer w0.3: C9.2 R6.1 8.06,26.25 arc(8.03,26.25) 8,26.23 ; CN1.1 8,26.23 ; 8,26.23 8,25.21 arc(7.87,24.55) R5.3
$1N37762: length 6.8
  Bottom Layer w0.3: CN4.1 38,25.21 arc(37.87,24.55) R40.3 ; 38.06,26.25 R42.1 C30.2
$1N42503: length 19
  Bottom Layer w0.5: 53.9,15 CN5.1 53.9,15.95 arc(53,20.49) 50.43,24.34 arc(50.18,24.7) 50.1,25.13 50.1,25.9 arc(49.84,26.54) 49.2,26.8 48.3,26.8 arc(47.45,27.15) P1.3 47.1,27.23 arc(46.89,26.19) 46.3,25.3
$1N42542: length 15.8
  Bottom Layer w0.3: P1.1 51.1,26.33 arc(51.19,25.84) 51.44,25.4
  Bottom Layer w0.5: F2.1 55.7,18.5 arc(57.09,16.82) CN5.3 ; 51.44,25.4 arc(51.51,25.13) 51.69,24.91
$1N42787: length 6.5
  Bottom Layer w0.3: R48.1 arc(42.16,24.8) 41.8,26.63 41.8,28 43.18,28 arc(43.19,28) 43.21,28.01
$1N42798: length 23.3
  Bottom Layer w0.3: 48.51,21.75 49.76,21.75 arc(50.25,21.54) 50.45,21.05 TV1.1 ; 48.51,21.75 46.95,21.75 ; 48.51,21.75 arc(48.54,21.74) 48.55,21.71 TV1.2 ; 46.95,21.75 C1.2 ; 46.95,21.75 arc(46.95,21.74) 46.95,21.74 U2.3 ; U1.3 43.45,21.59 arc(43.47,21.67) 43.52,21.75 ; U2.1 45.05,21.63 arc(45.14,21.67) C2.1 ; U1.1 41.55,21.63 arc(41.64,21.67) C3.1
  Bottom Layer w0.5: 44.19,21.75 44.19,23.96 arc(44.03,24.75) 43.56,25.4 ; 44.19,21.75 C3.1 ; 44.19,21.75 C2.1 C1.2
$1N53934: length 17.1
  Bottom Layer w0.3: R26.2 49.47,11.53 arc(49.86,10.94) C17.2 49.59,9.84 arc(49.15,9.19) 49,8.42 49,6.69 arc(49.31,5.94) 50.05,5.64 U5.3 ; R26.3 R23.1 ; R26.1 46.97,11.53 arc(47.36,10.94) R30.2
  Bottom Layer w0.4: R26.1 R26.2 R26.3
$1N61093: length 17
  Bottom Layer w0.3: U5.6 56.84,5.64 arc(57.66,5.98) 58,6.8 58,8.69 arc(58.13,9.35) 58.5,9.9 58.75,10.15 arc(58.86,10.23) C18.2 R27.2 ; R31.2 57,10.79 arc(56.87,11.45) R27.1 R27.2 ; R27.2 R27.3 61.03,11.53 arc(60.64,10.94) R24.1

## Copper pours and planes (outline as drawn; the poured copper is in the pictures)
GND on Top Layer: 0,30 64,30 64,0 0,0
GND on Inner2: 56,16 56.8,16 56.8,14.09 56,14.09
GND on Inner2: 1.6,28.4 2.4,28.4 2.4,26.58 1.6,26.58
GND on Inner2: 20.58,28.4 22.4,28.4 22.4,27.6 20.58,27.6
GND on Inner2: 56,17.11 56.8,17.11 56.8,15.2 56,15.2
GND on Inner2: 48.7,28.4 49.5,28.4 49.5,26.58 48.7,26.58
GND on Inner2: 23.95,2.4 25.86,2.4 25.86,1.6 23.95,1.6
GND on Inner2: 30.58,28.4 32.4,28.4 32.4,27.6 30.58,27.6
GND on Inner2: 31.6,28.4 32.4,28.4 32.4,26.58 31.6,26.58
GND on Inner2: 25.06,2.4 25.86,2.4 25.86,0.49 25.06,0.49
GND on Inner2: 31.6,29.42 32.4,29.42 32.4,27.6 31.6,27.6
GND on Inner2: 1.6,29.42 2.4,29.42 2.4,27.6 1.6,27.6
GND on Inner2: 0.58,28.4 2.4,28.4 2.4,27.6 0.58,27.6
GND on Inner2: 21.6,29.42 22.4,29.42 22.4,27.6 21.6,27.6
GND on Inner2: 10.58,28.4 12.4,28.4 12.4,27.6 10.58,27.6
GND on Inner2: 11.6,28.4 12.4,28.4 12.4,26.58 11.6,26.58
GND on Inner2: 11.6,29.42 12.4,29.42 12.4,27.6 11.6,27.6
GND on Inner2: 25.06,3.51 25.86,3.51 25.86,1.6 25.06,1.6
GND on Inner2: 0.26,29.74 63.74,29.74 63.74,0.26 0.26,0.26
GND on Inner2: 48.7,29.42 49.5,29.42 49.5,27.6 48.7,27.6
GND on Inner2: 21.6,28.4 22.4,28.4 22.4,26.58 21.6,26.58
VCC on Inner1: 0.5,21.66 63.5,21.66 63.5,0.5 0.5,0.5
VCCREF on Inner1: 0.5,29.5 63.5,29.5 63.5,6.66 0.5,6.66

Small or netless copper shapes (teardrops, artwork), in the pictures only: 406 on Bottom Layer, 32 on Inner1

## Text on the board
Top Silkscreen Layer: REF | ZERO | THRE | G T1 T2 | Sensor: G 2 1 V | +5V | GND | OUT
